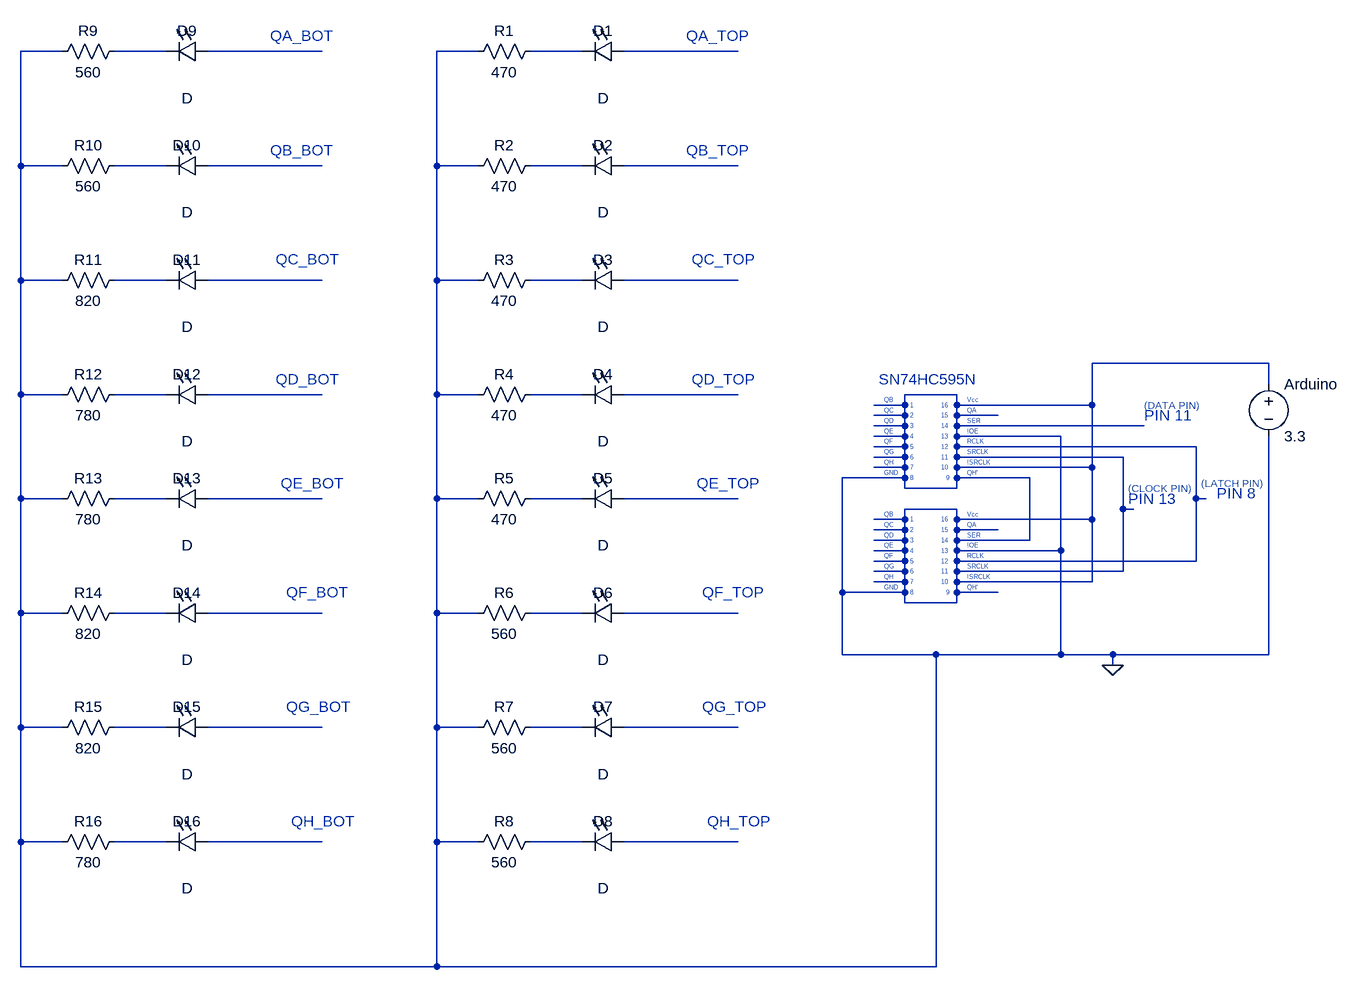
[diagram p0: schematic schematic.asc]
schematic.asc, the LTspice schematic file:
Version 4
SHEET 1 880 1040
WIRE -1152 -464 -1216 -464
WIRE -992 -464 -1072 -464
WIRE -752 -464 -928 -464
WIRE -512 -464 -576 -464
WIRE -352 -464 -432 -464
WIRE -112 -464 -288 -464
WIRE -1216 -288 -1216 -464
WIRE -1152 -288 -1216 -288
WIRE -992 -288 -1072 -288
WIRE -752 -288 -928 -288
WIRE -576 -288 -576 -464
WIRE -512 -288 -576 -288
WIRE -352 -288 -432 -288
WIRE -112 -288 -288 -288
WIRE -1216 -112 -1216 -288
WIRE -1152 -112 -1216 -112
WIRE -992 -112 -1072 -112
WIRE -752 -112 -928 -112
WIRE -576 -112 -576 -288
WIRE -512 -112 -576 -112
WIRE -352 -112 -432 -112
WIRE -112 -112 -288 -112
WIRE 704 16 432 16
WIRE 704 48 704 16
WIRE -1216 64 -1216 -112
WIRE -1152 64 -1216 64
WIRE -992 64 -1072 64
WIRE -752 64 -928 64
WIRE -576 64 -576 -112
WIRE -512 64 -576 64
WIRE -352 64 -432 64
WIRE -112 64 -288 64
WIRE 224 64 144 64
WIRE 144 80 144 64
WIRE 144 80 96 80
WIRE 224 80 224 64
WIRE 432 80 432 16
WIRE 432 80 224 80
WIRE 144 96 144 80
WIRE 144 96 96 96
WIRE 224 96 224 80
WIRE 288 96 224 96
WIRE 144 112 144 96
WIRE 144 112 96 112
WIRE 224 112 224 96
WIRE 512 112 224 112
WIRE 144 128 144 112
WIRE 144 128 96 128
WIRE 224 128 224 112
WIRE 384 128 224 128
WIRE 144 144 144 128
WIRE 144 144 96 144
WIRE 224 144 224 128
WIRE 592 144 224 144
WIRE 144 160 144 144
WIRE 144 160 96 160
WIRE 224 160 224 144
WIRE 480 160 224 160
WIRE 144 176 144 160
WIRE 144 176 96 176
WIRE 224 176 224 160
WIRE 432 176 432 80
WIRE 432 176 224 176
WIRE 144 192 144 176
WIRE 144 192 48 192
WIRE 224 192 224 176
WIRE 336 192 224 192
WIRE 144 208 144 192
WIRE 224 208 224 192
WIRE 224 208 144 208
WIRE -1216 224 -1216 64
WIRE -1152 224 -1216 224
WIRE -992 224 -1072 224
WIRE -752 224 -928 224
WIRE -576 224 -576 64
WIRE -512 224 -576 224
WIRE -352 224 -432 224
WIRE -112 224 -288 224
WIRE 592 224 592 144
WIRE 608 224 592 224
WIRE 224 240 144 240
WIRE 480 240 480 160
WIRE 496 240 480 240
WIRE 144 256 144 240
WIRE 144 256 96 256
WIRE 224 256 224 240
WIRE 432 256 432 176
WIRE 432 256 224 256
WIRE 144 272 144 256
WIRE 144 272 96 272
WIRE 224 272 224 256
WIRE 288 272 224 272
WIRE 144 288 144 272
WIRE 144 288 96 288
WIRE 224 288 224 272
WIRE 336 288 336 192
WIRE 336 288 224 288
WIRE 144 304 144 288
WIRE 144 304 96 304
WIRE 224 304 224 288
WIRE 384 304 384 128
WIRE 384 304 224 304
WIRE 144 320 144 304
WIRE 144 320 96 320
WIRE 224 320 224 304
WIRE 592 320 592 224
WIRE 592 320 224 320
WIRE 144 336 144 320
WIRE 144 336 96 336
WIRE 224 336 224 320
WIRE 480 336 480 240
WIRE 480 336 224 336
WIRE 144 352 144 336
WIRE 144 352 96 352
WIRE 224 352 224 336
WIRE 432 352 432 256
WIRE 432 352 224 352
WIRE 48 368 48 192
WIRE 144 368 144 352
WIRE 144 368 48 368
WIRE 224 368 224 352
WIRE 288 368 224 368
WIRE 144 384 144 368
WIRE 224 384 224 368
WIRE 224 384 144 384
WIRE -1216 400 -1216 224
WIRE -1152 400 -1216 400
WIRE -992 400 -1072 400
WIRE -752 400 -928 400
WIRE -576 400 -576 224
WIRE -512 400 -576 400
WIRE -352 400 -432 400
WIRE -112 400 -288 400
WIRE 48 464 48 368
WIRE 192 464 48 464
WIRE 384 464 384 304
WIRE 384 464 192 464
WIRE 464 464 384 464
WIRE 704 464 704 128
WIRE 704 464 464 464
WIRE 464 480 464 464
WIRE -1216 576 -1216 400
WIRE -1152 576 -1216 576
WIRE -992 576 -1072 576
WIRE -752 576 -928 576
WIRE -576 576 -576 400
WIRE -512 576 -576 576
WIRE -352 576 -432 576
WIRE -112 576 -288 576
WIRE -1216 752 -1216 576
WIRE -1152 752 -1216 752
WIRE -992 752 -1072 752
WIRE -752 752 -928 752
WIRE -576 752 -576 576
WIRE -512 752 -576 752
WIRE -352 752 -432 752
WIRE -112 752 -288 752
WIRE -1216 944 -1216 752
WIRE -576 944 -576 752
WIRE -576 944 -1216 944
WIRE 192 944 192 464
WIRE 192 944 -576 944
FLAG 464 480 0
SYMBOL voltage 704 32 R0
WINDOW 123 0 0 Left 0
WINDOW 39 24 124 Left 2
SYMATTR InstName Arduino
SYMATTR Value 3.3
SYMBOL res -416 -480 R90
WINDOW 0 0 56 VBottom 2
WINDOW 3 32 56 VTop 2
SYMATTR InstName R1
SYMATTR Value 470
SYMBOL res -416 -304 R90
WINDOW 0 0 56 VBottom 2
WINDOW 3 32 56 VTop 2
SYMATTR InstName R2
SYMATTR Value 470
SYMBOL LED -288 -480 R90
WINDOW 0 0 32 VBottom 2
WINDOW 3 72 32 VTop 2
SYMATTR InstName D1
SYMBOL LED -288 -304 R90
WINDOW 0 0 32 VBottom 2
WINDOW 3 72 32 VTop 2
SYMATTR InstName D2
SYMBOL res -416 -128 R90
WINDOW 0 0 56 VBottom 2
WINDOW 3 32 56 VTop 2
SYMATTR InstName R3
SYMATTR Value 470
SYMBOL res -416 48 R90
WINDOW 0 0 56 VBottom 2
WINDOW 3 32 56 VTop 2
SYMATTR InstName R4
SYMATTR Value 470
SYMBOL LED -288 -128 R90
WINDOW 0 0 32 VBottom 2
WINDOW 3 72 32 VTop 2
SYMATTR InstName D3
SYMBOL LED -288 48 R90
WINDOW 0 0 32 VBottom 2
WINDOW 3 72 32 VTop 2
SYMATTR InstName D4
SYMBOL res -416 208 R90
WINDOW 0 0 56 VBottom 2
WINDOW 3 32 56 VTop 2
SYMATTR InstName R5
SYMATTR Value 470
SYMBOL res -416 384 R90
WINDOW 0 0 56 VBottom 2
WINDOW 3 32 56 VTop 2
SYMATTR InstName R6
SYMATTR Value 560
SYMBOL LED -288 208 R90
WINDOW 0 0 32 VBottom 2
WINDOW 3 72 32 VTop 2
SYMATTR InstName D5
SYMBOL LED -288 384 R90
WINDOW 0 0 32 VBottom 2
WINDOW 3 72 32 VTop 2
SYMATTR InstName D6
SYMBOL res -416 560 R90
WINDOW 0 0 56 VBottom 2
WINDOW 3 32 56 VTop 2
SYMATTR InstName R7
SYMATTR Value 560
SYMBOL res -416 736 R90
WINDOW 0 0 56 VBottom 2
WINDOW 3 32 56 VTop 2
SYMATTR InstName R8
SYMATTR Value 560
SYMBOL LED -288 560 R90
WINDOW 0 0 32 VBottom 2
WINDOW 3 72 32 VTop 2
SYMATTR InstName D7
SYMBOL LED -288 736 R90
WINDOW 0 0 32 VBottom 2
WINDOW 3 72 32 VTop 2
SYMATTR InstName D8
SYMBOL res -1056 -480 R90
WINDOW 0 0 56 VBottom 2
WINDOW 3 32 56 VTop 2
SYMATTR InstName R9
SYMATTR Value 560
SYMBOL res -1056 -304 R90
WINDOW 0 0 56 VBottom 2
WINDOW 3 32 56 VTop 2
SYMATTR InstName R10
SYMATTR Value 560
SYMBOL LED -928 -480 R90
WINDOW 0 0 32 VBottom 2
WINDOW 3 72 32 VTop 2
SYMATTR InstName D9
SYMBOL LED -928 -304 R90
WINDOW 0 0 32 VBottom 2
WINDOW 3 72 32 VTop 2
SYMATTR InstName D10
SYMBOL res -1056 -128 R90
WINDOW 0 0 56 VBottom 2
WINDOW 3 32 56 VTop 2
SYMATTR InstName R11
SYMATTR Value 820
SYMBOL res -1056 48 R90
WINDOW 0 0 56 VBottom 2
WINDOW 3 32 56 VTop 2
SYMATTR InstName R12
SYMATTR Value 780
SYMBOL LED -928 -128 R90
WINDOW 0 0 32 VBottom 2
WINDOW 3 72 32 VTop 2
SYMATTR InstName D11
SYMBOL LED -928 48 R90
WINDOW 0 0 32 VBottom 2
WINDOW 3 72 32 VTop 2
SYMATTR InstName D12
SYMBOL res -1056 208 R90
WINDOW 0 0 56 VBottom 2
WINDOW 3 32 56 VTop 2
SYMATTR InstName R13
SYMATTR Value 780
SYMBOL res -1056 384 R90
WINDOW 0 0 56 VBottom 2
WINDOW 3 32 56 VTop 2
SYMATTR InstName R14
SYMATTR Value 820
SYMBOL LED -928 208 R90
WINDOW 0 0 32 VBottom 2
WINDOW 3 72 32 VTop 2
SYMATTR InstName D13
SYMBOL LED -928 384 R90
WINDOW 0 0 32 VBottom 2
WINDOW 3 72 32 VTop 2
SYMATTR InstName D14
SYMBOL res -1056 560 R90
WINDOW 0 0 56 VBottom 2
WINDOW 3 32 56 VTop 2
SYMATTR InstName R15
SYMATTR Value 820
SYMBOL res -1056 736 R90
WINDOW 0 0 56 VBottom 2
WINDOW 3 32 56 VTop 2
SYMATTR InstName R16
SYMATTR Value 780
SYMBOL LED -928 560 R90
WINDOW 0 0 32 VBottom 2
WINDOW 3 72 32 VTop 2
SYMATTR InstName D15
SYMBOL LED -928 736 R90
WINDOW 0 0 32 VBottom 2
WINDOW 3 72 32 VTop 2
SYMATTR InstName D16
TEXT 104 40 Left 2 ;SN74HC595N
TEXT 152 80 Left 0 ;1
TEXT 152 96 Left 0 ;2
TEXT 152 112 Left 0 ;3
TEXT 152 128 Left 0 ;4
TEXT 152 144 Left 0 ;5
TEXT 152 160 Left 0 ;6
TEXT 152 176 Left 0 ;7
TEXT 152 192 Left 0 ;8
TEXT 208 192 Left 0 ;9
TEXT 200 176 Left 0 ;10
TEXT 200 160 Left 0 ;11
TEXT 200 144 Left 0 ;12
TEXT 200 128 Left 0 ;13
TEXT 200 112 Left 0 ;14
TEXT 200 96 Left 0 ;15
TEXT 200 80 Left 0 ;16
TEXT 240 72 Left 0 ;Vcc
TEXT 240 88 Left 0 ;QA
TEXT 240 104 Left 0 ;SER
TEXT 240 120 Left 0 ;!OE
TEXT 240 136 Left 0 ;RCLK
TEXT 240 152 Left 0 ;SRCLK
TEXT 240 168 Left 0 ;!SRCLK
TEXT 240 184 Left 0 ;QH'
TEXT 112 184 Left 0 ;GND
TEXT 112 168 Left 0 ;QH
TEXT 112 152 Left 0 ;QG
TEXT 112 136 Left 0 ;QF
TEXT 112 120 Left 0 ;QE
TEXT 112 104 Left 0 ;QD
TEXT 112 88 Left 0 ;QC
TEXT 112 72 Left 0 ;QB
TEXT 152 256 Left 0 ;1
TEXT 152 272 Left 0 ;2
TEXT 152 288 Left 0 ;3
TEXT 152 304 Left 0 ;4
TEXT 152 320 Left 0 ;5
TEXT 152 336 Left 0 ;6
TEXT 152 352 Left 0 ;7
TEXT 152 368 Left 0 ;8
TEXT 208 368 Left 0 ;9
TEXT 200 352 Left 0 ;10
TEXT 200 336 Left 0 ;11
TEXT 200 320 Left 0 ;12
TEXT 200 304 Left 0 ;13
TEXT 200 288 Left 0 ;14
TEXT 200 272 Left 0 ;15
TEXT 200 256 Left 0 ;16
TEXT 240 248 Left 0 ;Vcc
TEXT 240 264 Left 0 ;QA
TEXT 240 280 Left 0 ;SER
TEXT 240 296 Left 0 ;!OE
TEXT 240 312 Left 0 ;RCLK
TEXT 240 328 Left 0 ;SRCLK
TEXT 240 344 Left 0 ;!SRCLK
TEXT 240 360 Left 0 ;QH'
TEXT 112 360 Left 0 ;GND
TEXT 112 344 Left 0 ;QH
TEXT 112 328 Left 0 ;QG
TEXT 112 312 Left 0 ;QF
TEXT 112 296 Left 0 ;QE
TEXT 112 280 Left 0 ;QD
TEXT 112 264 Left 0 ;QC
TEXT 112 248 Left 0 ;QB
TEXT 512 96 Left 2 ;PIN 11
TEXT 624 216 Left 2 ;PIN 8
TEXT 488 224 Left 2 ;PIN 13
TEXT 512 80 Left 1 ;(DATA PIN)
TEXT 600 200 Left 1 ;(LATCH PIN)
TEXT 488 208 Left 1 ;(CLOCK PIN)
TEXT -192 -488 Left 2 ;QA_TOP
TEXT -192 -312 Left 2 ;QB_TOP
TEXT -184 -144 Left 2 ;QC_TOP
TEXT -184 40 Left 2 ;QD_TOP
TEXT -176 200 Left 2 ;QE_TOP
TEXT -168 368 Left 2 ;QF_TOP
TEXT -168 544 Left 2 ;QG_TOP
TEXT -160 720 Left 2 ;QH_TOP
TEXT -832 -488 Left 2 ;QA_BOT
TEXT -832 -312 Left 2 ;QB_BOT
TEXT -824 -144 Left 2 ;QC_BOT
TEXT -824 40 Left 2 ;QD_BOT
TEXT -816 200 Left 2 ;QE_BOT
TEXT -808 368 Left 2 ;QF_BOT
TEXT -808 544 Left 2 ;QG_BOT
TEXT -800 720 Left 2 ;QH_BOT

The netlist it stands for:
* schematic.asc
V§Arduino 0 0 3.3
R1 N003 0 470
R2 N007 0 470
D1 N004 N003 D
D2 N008 N007 D
R3 N011 0 470
R4 N015 0 470
D3 N012 N011 D
D4 N016 N015 D
R5 N019 0 470
R6 N023 0 560
D5 N020 N019 D
D6 N024 N023 D
R7 N027 0 560
R8 N031 0 560
D7 N028 N027 D
D8 N032 N031 D
R9 N001 0 560
R10 N005 0 560
D9 N002 N001 D
D10 N006 N005 D
R11 N009 0 820
R12 N013 0 780
D11 N010 N009 D
D12 N014 N013 D
R13 N017 0 780
R14 N021 0 820
D13 N018 N017 D
D14 N022 N021 D
R15 N025 0 820
R16 N029 0 780
D15 N026 N025 D
D16 N030 N029 D
.model D D
.lib standard.dio
* SN74HC595N
* 1
* 2
* 3
* 4
* 5
* 6
* 7
* 8
* 9
* 10
* 11
* 12
* 13
* 14
* 15
* 16
* Vcc
* QA
* SER
* !OE
* RCLK
* SRCLK
* !SRCLK
* QH'
* GND
* QH
* QG
* QF
* QE
* QD
* QC
* QB
* 1
* 2
* 3
* 4
* 5
* 6
* 7
* 8
* 9
* 10
* 11
* 12
* 13
* 14
* 15
* 16
* Vcc
* QA
* SER
* !OE
* RCLK
* SRCLK
* !SRCLK
* QH'
* GND
* QH
* QG
* QF
* QE
* QD
* QC
* QB
* PIN 11
* PIN 8
* PIN 13
* (DATA PIN)
* (LATCH PIN)
* (CLOCK PIN)
* QA_TOP
* QB_TOP
* QC_TOP
* QD_TOP
* QE_TOP
* QF_TOP
* QG_TOP
* QH_TOP
* QA_BOT
* QB_BOT
* QC_BOT
* QD_BOT
* QE_BOT
* QF_BOT
* QG_BOT
* QH_BOT
.backanno
.end